# Altium schematic sheet UART_USB.SchDoc
size A4
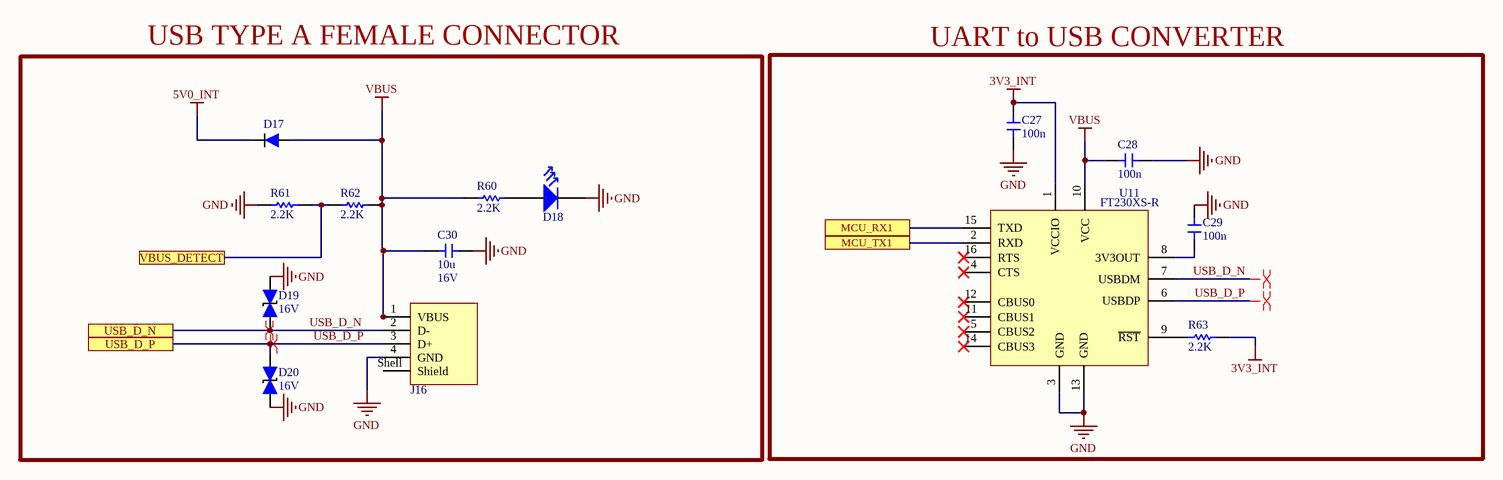
[diagram p0: UART_USB.SchDoc]

## Parts
C27  value 100n  [CAP_0402_CER]  (hidden comment: CL05B104KP5NNNC)
C28  value 100n  [CAP_0402_CER]  (hidden comment: CL05B104KP5NNNC)
C29  value 100n  [CAP_0402_CER]  (hidden comment: CL05B104KP5NNNC)
C30  value 10u  Voltage: 16V  [CAP_0805_CER]  (hidden comment: CL21A106KOQNNNE)
D17  BAT42WS-E3-08  [SOD323F]  (value not drawn)
D18  *  [LED_0805_SMD]  (value not drawn)
D19  value 16V  [SOD-123F]  (hidden comment: SMF16CA)
D20  value 16V  [SOD-123F]  (hidden comment: SMF16CA)
J16  UJ2-BH-1-TH  [61400416021]  (value not drawn)
R60  value 2.2K  [RES_0402_SMD]  (hidden comment: RMCF0402JT2K20)
R61  value 2.2K  [RES_0402_SMD]  (hidden comment: RMCF0402JT2K20)
R62  value 2.2K  [RES_0402_SMD]  (hidden comment: RMCF0402JT2K20)
R63  value 2.2K  [RES_0402_SMD]  (hidden comment: RMCF0402JT2K20)
U11  FT230XS-R  [16-SSOP]

## Blocks framed on the sheet
USB TYPE A FEMALE CONNECTOR: C30 D17-D20 J16 R60-R62
UART to USB CONVERTER: C27-C29 R63 U11

## Ports
MCU_RX1, MCU_TX1, USB_D_N, USB_D_P, VBUS_DETECT

## Nets
3V3_INT: C27.1 R63.2 U11.1(VCCIO)
5V0_INT: D17.1(C)
GND: C27.2 C28.1 C29.1 C30.1 D18.C D19.1(C) D20.2(A) J16.4(GND) R61.1 U11.3(GND) U11.13(GND)
VBUS: C28.2 C30.2 D17.2(A) J16.1(VBUS) R60.1 R62.2 U11.10(VCC)
MCU_RX1: U11.15(TXD) ; port MCU_RX1
MCU_TX1: U11.2(RXD) ; port MCU_TX1
USB_D_N: D19.2(A) J16.2(D-) U11.7(USBDM) ; port USB_D_N
USB_D_P: D20.1(C) J16.3(D+) U11.6(USBDP) ; port USB_D_P
VBUS_DETECT: R61.2 R62.1 ; port VBUS_DETECT
NetC29_2: C29.2 U11.8(3V3OUT)
NetD18_A: D18.A R60.2
NetR63_1: R63.1 U11.9(~{RST})

Not connected (* = marked no-connect by the designer): J16 Shell(Shield); U11 4(CTS)* 5(CBUS2)* 11(CBUS1)* 12(CBUS0)* 14(CBUS3)* 16(RTS)*

## Layout directives
differential pair: USB_D_N, USB_D_P

## Library data of the parts
C27-C29 = CAP_GEN_CER: Generic; Voltage: 10V; Place: P; Part Number: CL05B104KP5NNNC; Power: *; Package: *; Tolerance: *; Operating Temp.: *
C30 = CAP_GEN_CER: Generic; Place: P; Part Number: CL21A106KOQNNNE; Power: *; Package: *; Tolerance: *; Operating Temp.: *
D17 = BAT42WS-E3-08: DIODE SCHOTTKY 30V 200MA; Place: POP; Part Number: BAT42WS-E3-08; Value: 200mA; Voltage: 30V; Power: N/A; Tolerance: N/A; Package: SC-76; Operating Temp.: -55°C ~ 125°C
D18 = LED_GEN: Place: P/DNP; Part Number: *; Value: *; Voltage: *; Power: *; Tolerance: *; Package: *; Operating Temp.: *
D19 D20 = SMF16CA: Unidirectional TVS DIODE 200W 16V-17.8V SOD-123; Manufacturer: ANBON SEMI; Voltage: 17.8V; Place: POP; Part Number: SMF16CA; Power: 200W; Tolerance: N/A; Package: SOD-123F; Operating Temp.: -55°C ~ 150°C
J16 = 61400416021: WR-COM USB 2.0 Type A Horizontal; Manufacturer: Wurth Elektronik; Match Code: WR-USB; Gender: Receptacle; Interface Type: Type A; Number of Ports: 1; Rated Current: 1.5A; Working Voltage: 30V (AC); Manufacturer Part Number: 61400416021; Category: Input/Output Connectors; ComponentLink1Description: Website Link; ComponentLink1URL: https://www.we-online.com/redexpert/article/61400416021?ad; ComponentLink2Description: Datasheet Link; ComponentLink2URL: https://www.we-online.com/redexpert/spec/61400416021?ad; Mount: Through Hole; Operating Temperature Max: 105°C; Operating Temperature Min: -40°C; Packaging: Tray; Application: USB 2.0; Number of Pins: 4; Orientation: Horizontal
R60-R63 = RES_GEN_SMD: Generic Chip Res; Place: P; Package: *; Part Number: RMCF0402JT2K20; Power: *; Tolerance: *; Voltage: *; Operating Temp.: *
U11 = FT230XS-R: IC USB SERIAL BASIC UART 16SSOP; Operatig Temp.: -40°C ~ 85°C; Place: POP; Part Number: FT230XS-R; Value: N/A; Voltage: N/A; Power: N/A; Tolerance: N/A; Package: 16-SSOP